# Altium schematic sheet Main.SchDoc
size A4
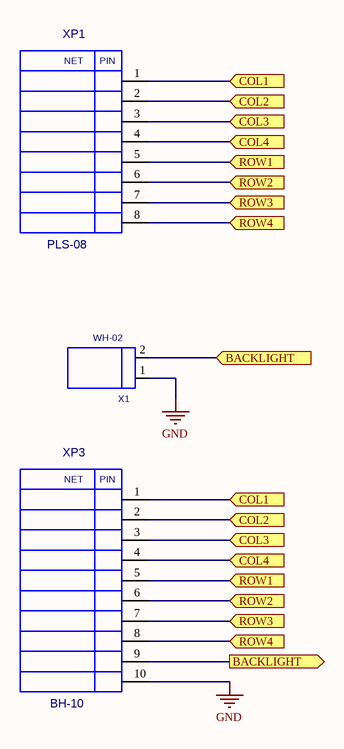
[diagram p0: Main.SchDoc]

## Parts
X1  WH-02  [WH-02]
XP1  PLS-08  [PLS-08]
XP3  BH-10  [BH-10]

## Ports
BACKLIGHT (in), BACKLIGHT (out), COL1 (in), COL2 (in), COL3 (in), COL4 (in), ROW1 (in), ROW2 (in), ROW3 (in), ROW4 (in)

## Nets
GND: X1.1 XP3.10
BACKLIGHT: X1.2 XP3.9 ; port BACKLIGHT
COL1: XP1.1 XP3.1 ; port COL1
COL2: XP1.2 XP3.2 ; port COL2
COL3: XP1.3 XP3.3 ; port COL3
COL4: XP1.4 XP3.4 ; port COL4
ROW1: XP1.5 XP3.5 ; port ROW1
ROW2: XP1.6 XP3.6 ; port ROW2
ROW3: XP1.7 XP3.7 ; port ROW3
ROW4: XP1.8 XP3.8 ; port ROW4

## Notes on the sheet
- (in symbol BH-10) NET; PIN
- (in symbol PLS-08) NET; PIN

## Library data of the parts
X1 = WH-02: Value: *
XP1 = PLS-08: Value: *
XP3 = BH-10: Value: *